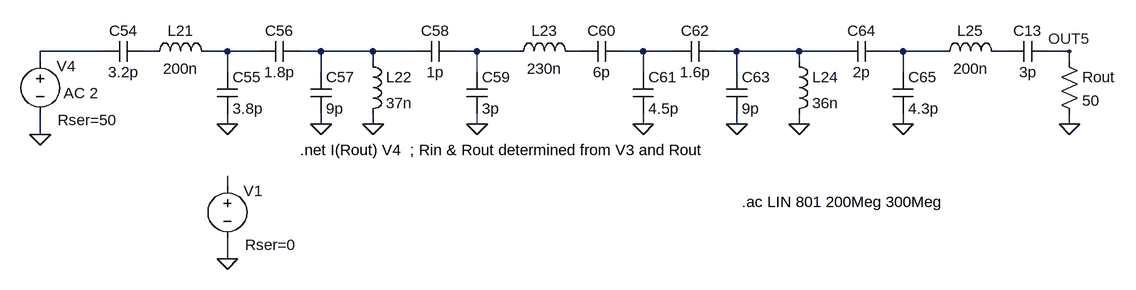
[diagram p0: schematic S.asc]
S.asc, the LTspice schematic file:
Version 4
SHEET 1 2384 1052
WIRE 128 400 32 400
WIRE 208 400 192 400
WIRE 320 400 288 400
WIRE 368 400 320 400
WIRE 464 400 432 400
WIRE 544 400 464 400
WIRE 608 400 544 400
WIRE 704 400 672 400
WIRE 768 400 704 400
WIRE 864 400 848 400
WIRE 960 400 928 400
WIRE 1008 400 960 400
WIRE 1104 400 1072 400
WIRE 1200 400 1104 400
WIRE 1264 400 1200 400
WIRE 1360 400 1328 400
WIRE 1424 400 1360 400
WIRE 1520 400 1504 400
WIRE 1616 400 1584 400
WIRE 32 416 32 400
WIRE 544 416 544 400
WIRE 1200 416 1200 400
WIRE 1616 416 1616 400
WIRE 320 432 320 400
WIRE 464 432 464 400
WIRE 704 432 704 400
WIRE 960 432 960 400
WIRE 1104 432 1104 400
WIRE 1360 432 1360 400
WIRE 320 512 320 496
WIRE 464 512 464 496
WIRE 544 512 544 496
WIRE 704 512 704 496
WIRE 960 512 960 496
WIRE 1104 512 1104 496
WIRE 1200 512 1200 496
WIRE 1360 512 1360 496
WIRE 1616 512 1616 496
WIRE 32 528 32 496
WIRE 320 608 320 592
WIRE 320 720 320 688
FLAG 32 528 0
FLAG 1616 512 0
FLAG 1616 400 OUT5
FLAG 320 512 0
FLAG 464 512 0
FLAG 544 512 0
FLAG 704 512 0
FLAG 960 512 0
FLAG 1104 512 0
FLAG 1200 512 0
FLAG 1360 512 0
FLAG 320 720 0
SYMBOL res 1600 400 R0
SYMATTR InstName Rout
SYMATTR Value 50
SYMBOL voltage 32 400 R0
WINDOW 0 25 23 Left 2
WINDOW 3 25 93 Left 2
WINDOW 123 36 64 Left 2
WINDOW 39 27 106 Left 2
SYMATTR InstName V4
SYMATTR Value ""
SYMATTR Value2 AC 2
SYMATTR SpiceLine Rser=50
SYMBOL cap 128 384 M90
WINDOW 0 0 32 VBottom 2
WINDOW 3 32 32 VTop 2
SYMATTR InstName C54
SYMATTR Value 3.2p
SYMBOL ind 192 416 R270
WINDOW 0 32 56 VTop 2
WINDOW 3 5 56 VBottom 2
SYMATTR InstName L21
SYMATTR Value 200n
SYMBOL cap 304 432 R0
SYMATTR InstName C55
SYMATTR Value 3.8p
SYMBOL cap 368 384 M90
WINDOW 0 0 32 VBottom 2
WINDOW 3 32 32 VTop 2
SYMATTR InstName C56
SYMATTR Value 1.8p
SYMBOL cap 448 432 R0
SYMATTR InstName C57
SYMATTR Value 9p
SYMBOL ind 528 400 R0
SYMATTR InstName L22
SYMATTR Value 37n
SYMBOL cap 608 384 M90
WINDOW 0 0 32 VBottom 2
WINDOW 3 32 32 VTop 2
SYMATTR InstName C58
SYMATTR Value 1p
SYMBOL cap 688 432 R0
SYMATTR InstName C59
SYMATTR Value 3p
SYMBOL ind 752 416 R270
WINDOW 0 32 56 VTop 2
WINDOW 3 5 56 VBottom 2
SYMATTR InstName L23
SYMATTR Value 230n
SYMBOL cap 864 384 M90
WINDOW 0 0 32 VBottom 2
WINDOW 3 32 32 VTop 2
SYMATTR InstName C60
SYMATTR Value 6p
SYMBOL cap 944 432 R0
SYMATTR InstName C61
SYMATTR Value 4.5p
SYMBOL cap 1008 384 M90
WINDOW 0 0 32 VBottom 2
WINDOW 3 32 32 VTop 2
SYMATTR InstName C62
SYMATTR Value 1.6p
SYMBOL cap 1088 432 R0
SYMATTR InstName C63
SYMATTR Value 9p
SYMBOL ind 1184 400 R0
SYMATTR InstName L24
SYMATTR Value 36n
SYMBOL cap 1264 384 M90
WINDOW 0 0 32 VBottom 2
WINDOW 3 32 32 VTop 2
SYMATTR InstName C64
SYMATTR Value 2p
SYMBOL cap 1344 432 R0
SYMATTR InstName C65
SYMATTR Value 4.3p
SYMBOL ind 1408 416 R270
WINDOW 0 32 56 VTop 2
WINDOW 3 5 56 VBottom 2
SYMATTR InstName L25
SYMATTR Value 200n
SYMBOL cap 1520 384 M90
WINDOW 0 0 32 VBottom 2
WINDOW 3 32 32 VTop 2
SYMATTR InstName C13
SYMATTR Value 3p
SYMBOL voltage 320 592 R0
WINDOW 0 25 23 Left 2
WINDOW 3 25 93 Left 2
WINDOW 123 36 64 Left 2
WINDOW 39 27 106 Left 2
SYMATTR InstName V1
SYMATTR Value ""
SYMATTR SpiceLine Rser=0
TEXT 1112 632 Left 2 !.ac LIN 801 200Meg 300Meg
TEXT 432 552 Left 2 !.net I(Rout) V4  ; Rin & Rout determined from V3 and Rout

The netlist it stands for:
* S.asc
Rout OUT5 0 50
V4 N001 0 AC 2 Rser=50
C54 N001 N002 3.2p
L21 N002 N003 200n
C55 N003 0 3.8p
C56 N003 N004 1.8p
C57 N004 0 9p
L22 N004 0 37n
C58 N004 N005 1p
C59 N005 0 3p
L23 N005 N006 230n
C60 N006 N007 6p
C61 N007 0 4.5p
C62 N007 N008 1.6p
C63 N008 0 9p
L24 N008 0 36n
C64 N008 N009 2p
C65 N009 0 4.3p
L25 N009 N010 200n
C13 N010 OUT5 3p
V1 N011 0 Rser=0
.ac LIN 801 200Meg 300Meg
.net I(Rout) V4  ; Rin & Rout determined from V3 and Rout
.backanno
.end